# EAGLE design SmartCar Arduino V1 (EAGLE 9.6.2)
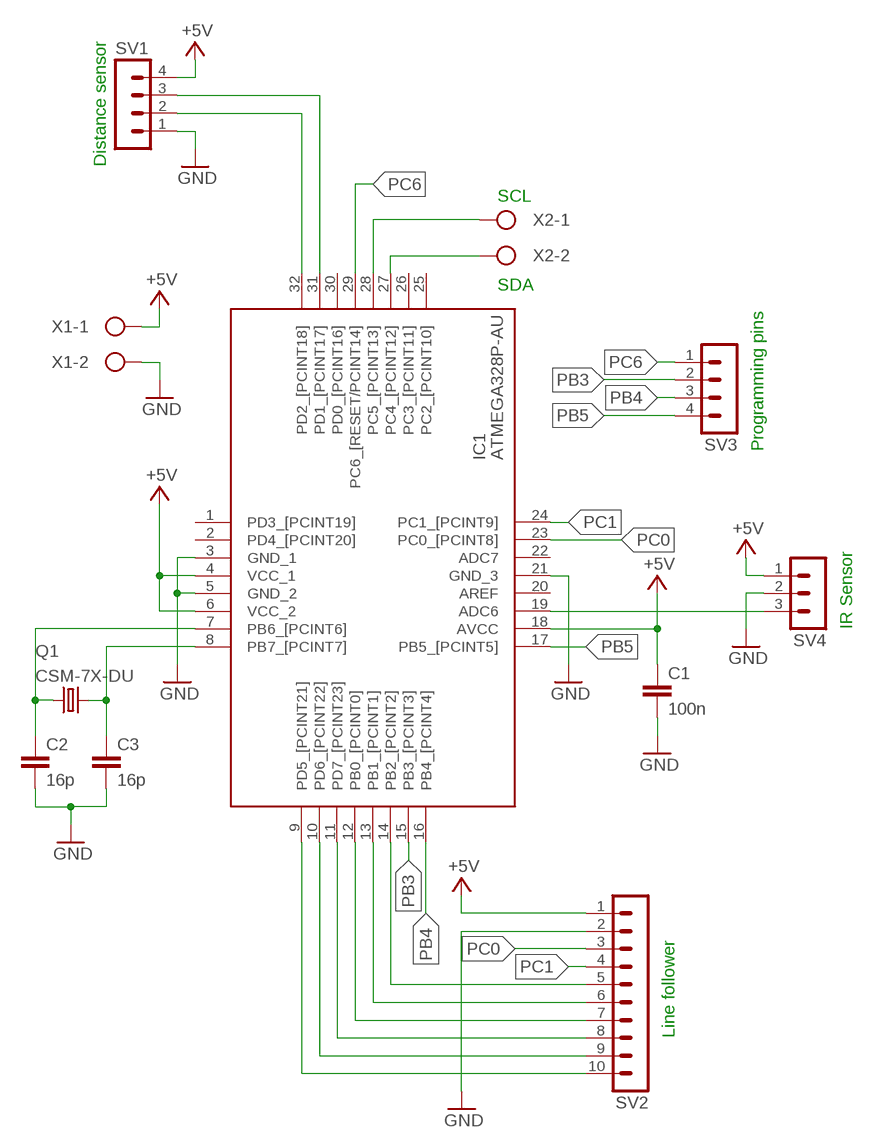
[diagram p0: schematic, sheet 1]

## Parts
C1  100n  C-EUC0805  [C0805]
C2  16p  C-EUC0805  [C0805]
C3  16p  C-EUC0805  [C0805]
IC1  ATMEGA328P-AU  [QFP80P900X900X120-32N]
Q1  CSM-7X-DU  [CSM-7X-DU]
SV1  MA04-1  [MA04-1]
SV2  MA10-1  [MA10-1]
SV3  MA04-1  [MA04-1]
SV4  MA03-1  [MA03-1]
X1  W237-102  [W237-102]
X2  W237-102  [W237-102]

## Nets
+5V: C1.1 IC1.4(VCC_1) IC1.6(VCC_2) IC1.18(AVCC) SV1.4 SV2.1 SV4.1 X1.1
GND: C1.2 C2.2 C3.2 IC1.3(GND_1) IC1.5(GND_2) IC1.21(GND_3) SV1.1 SV2.2 SV4.2 X1.2
N$1: IC1.27(PC4_[PCINT12]) X2.2
N$2: IC1.28(PC5_[PCINT13]) X2.1
N$3: C2.1 IC1.7(PB6_[PCINT6]) Q1.1
N$4: C3.1 IC1.8(PB7_[PCINT7]) Q1.2
N$5: IC1.32(PD2_[PCINT18]) SV1.2
N$6: IC1.31(PD1_[PCINT17]) SV1.3
N$7: IC1.19(ADC6) SV4.3
N$11: IC1.14(PB2_[PCINT2]) SV2.5
N$12: IC1.13(PB1_[PCINT1]) SV2.6
N$13: IC1.12(PB0_[PCINT0]) SV2.7
N$14: IC1.11(PD7_[PCINT23]) SV2.8
N$15: IC1.10(PD6_[PCINT22]) SV2.9
N$16: IC1.9(PD5_[PCINT21]) SV2.10
PB3: IC1.15(PB3_[PCINT3]) SV3.2
PB4: IC1.16(PB4_[PCINT4]) SV3.3
PB5: IC1.17(PB5_[PCINT5]) SV3.4
PC0: IC1.23(PC0_[PCINT8]) SV2.3
PC1: IC1.24(PC1_[PCINT9]) SV2.4
PC6: IC1.29(PC6_[RESET/PCINT14]) SV3.1
Unconnected: IC1.1(PD3_[PCINT19]) IC1.2(PD4_[PCINT20]) IC1.20(AREF) IC1.22(ADC7) IC1.25(PC2_[PCINT10]) IC1.26(PC3_[PCINT11]) IC1.30(PD0_[PCINT16])

## Notes on the sheet
- Distance sensor
- SCL
- SDA
- Programming pins
- IR Sensor
- Line follower

## Library data of the parts
C1-C3 = rcl:C-EU: CAPACITOR, European symbol; SPICEPREFIX: C
IC1 = ATMEGA328P-AU:ATMEGA328P-AU: MICROCHIP - ATMEGA328P-AU. - MICROCONTROLLER MCU, 8 BIT, ATMEGA, 20MHZ, TQFP-32 Source: Datasheet <https://componentsearchengine.com/Datasheets/2/ATMEGA328P-AU.pdf>; ARROW_PART_NUMBER: ATMEGA328P-AU; ARROW_PRICE-STOCK: https://www.arrow.com/en/products/atmega328p-au/microchip-technology?region=nac; DESCRIPTION: MICROCHIP - ATMEGA328P-AU. - MICROCONTROLLER MCU, 8 BIT, ATMEGA, 20MHZ, TQFP-32; HEIGHT: 1.2mm; MANUFACTURER_NAME: Microchip; MANUFACTURER_PART_NUMBER: ATMEGA328P-AU; MOUSER_PART_NUMBER: 556-ATMEGA328P-AU; MOUSER_PRICE-STOCK: https://www.mouser.co.uk/ProductDetail/Microchip-Technology-Atmel/ATMEGA328P-AU?qs=K8BHR703ZXiCmmgp6%2FGNmQ%3D%3D
Q1 = crystal:CSM-7X-DU: SMD CRYSTAL Source: www.ecsxtal.com .. Crystal 3.6864MHz CSM_7X_DU.PDF; OC_FARNELL: unknown; OC_NEWARK: unknown
SV1 SV3 = con-lstb:MA04-1: PIN HEADER; OC_FARNELL: unknown; OC_NEWARK: unknown
SV2 = con-lstb:MA10-1: PIN HEADER; OC_FARNELL: unknown; OC_NEWARK: unknown
SV4 = con-lstb:MA03-1: PIN HEADER; OC_FARNELL: unknown; OC_NEWARK: unknown
X1 X2 = con-wago-500:W237-102: WAGO SCREW CLAMP; MPN: 237-102; OC_FARNELL: unknown; OC_NEWARK: 70K9898

## Board
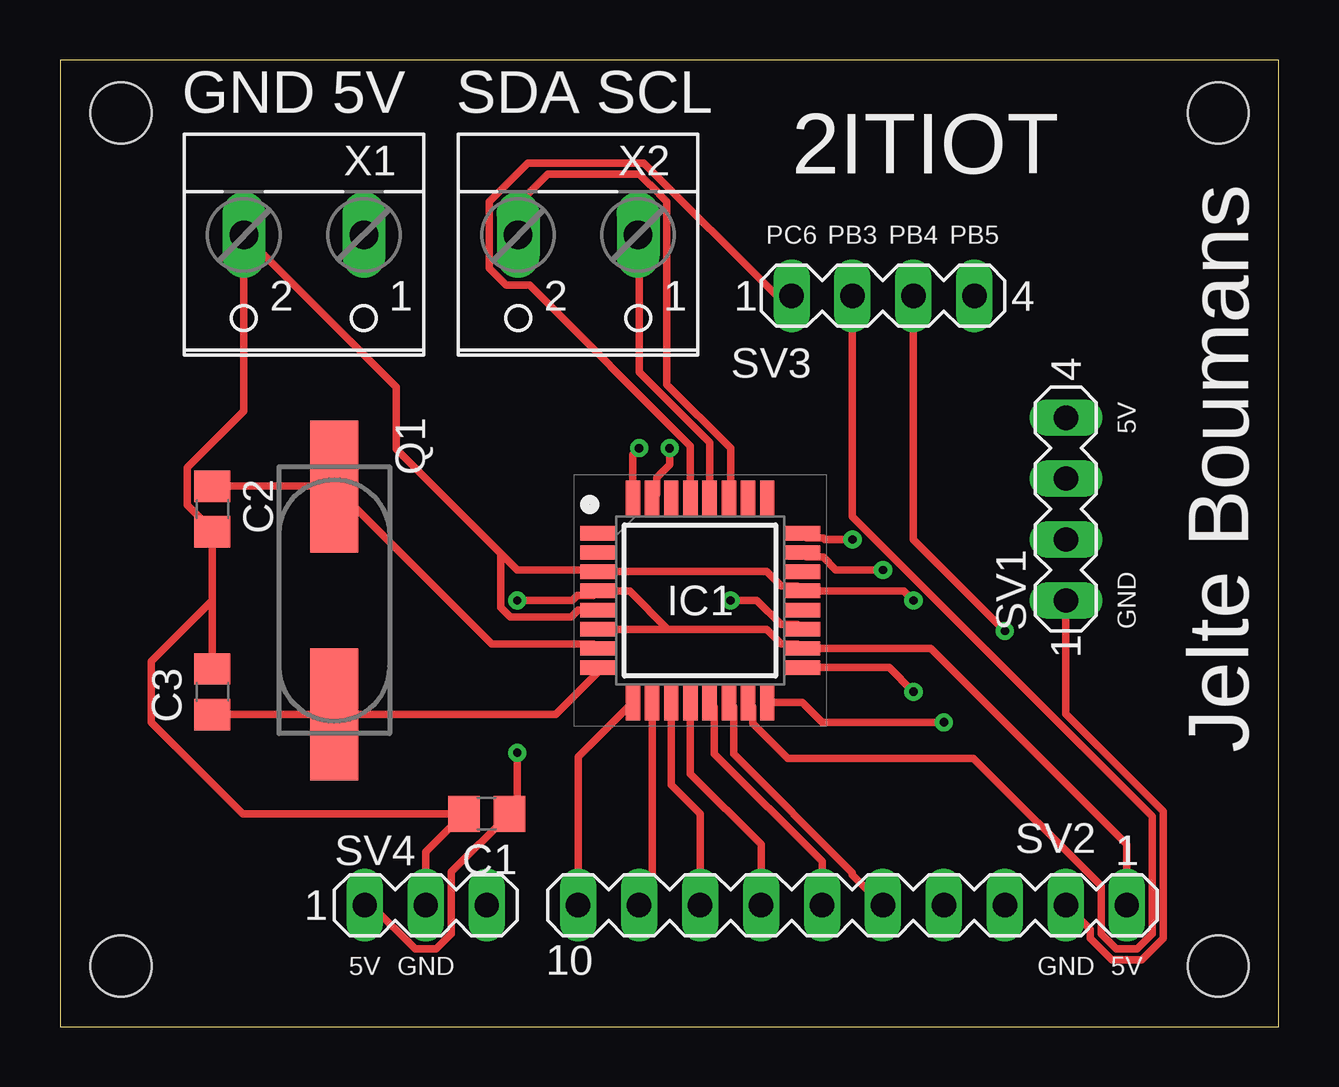
[diagram p1: board, top side]
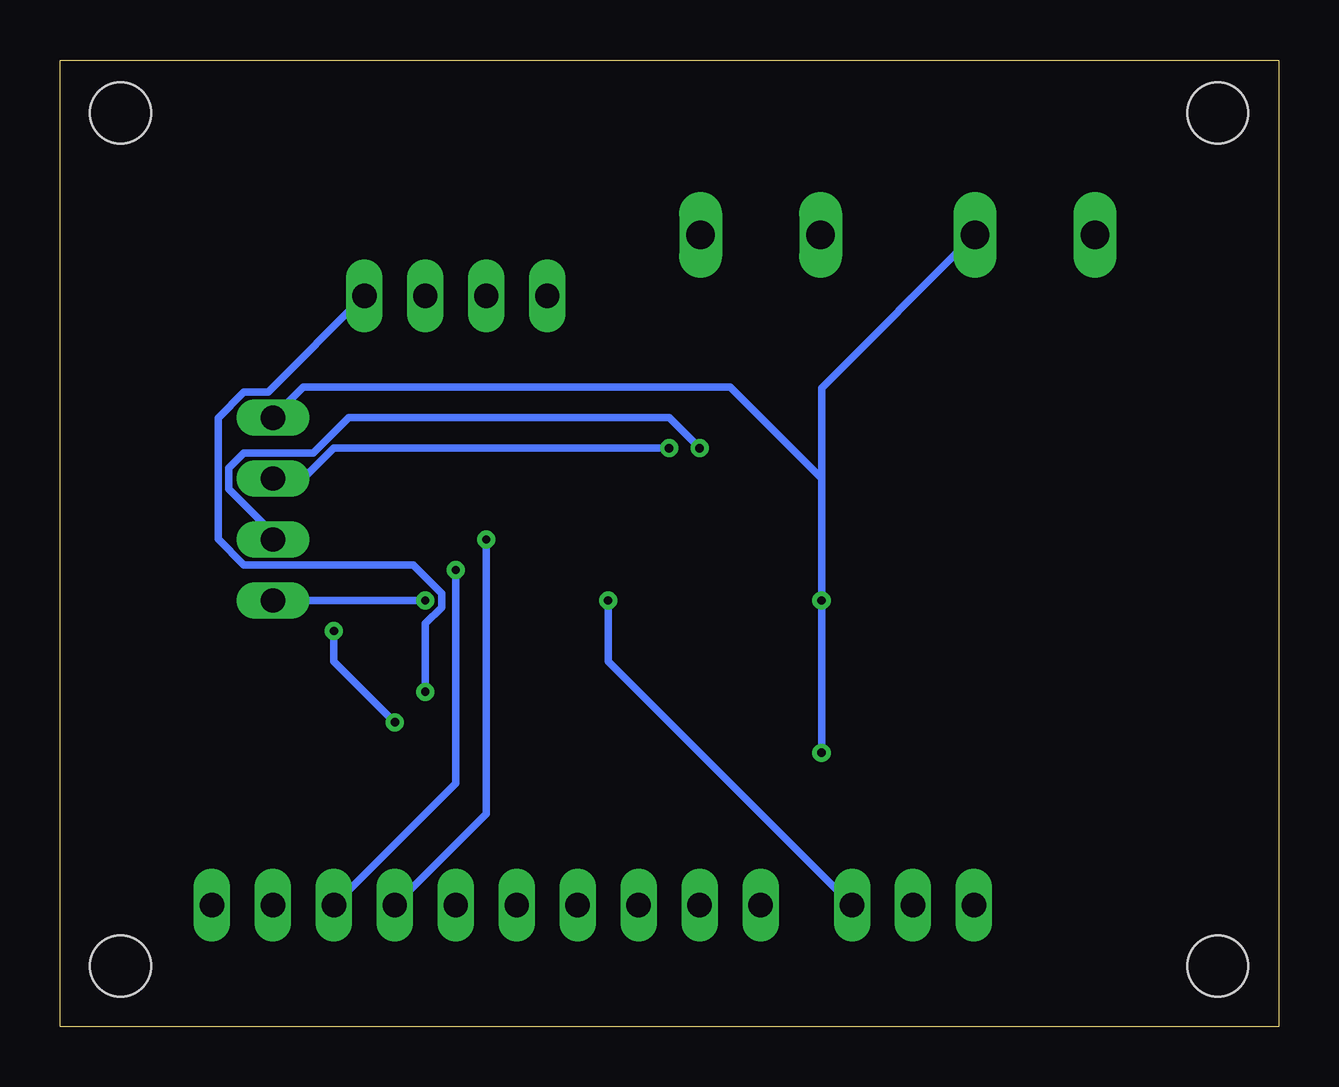
[diagram p2: board, bottom side, seen from below]

Size 50.78 x 40.31 mm. Coordinates in mm from the lower left corner, seen from the top.
Outline: 0,0 50.78,0 50.78,40.31 0,40.31 0,0
Copper layers (1*16): Top 0.035mm / dielectric 0.15mm / Bottom 0.035mm
Design rules "default": minimum track width 6mil, minimum drill 0.35mm, track to track 6mil, track to pad 6mil, pad to pad 6mil, via to via 6mil, smd to smd 6mil, copper to edge 40mil, drill to drill 6mil, minimum pad ring 10mil, minimum via ring 8mil, stop-mask expansion 4mil, vias tented up to drill 0mil, thermal gap 10mil
Holes 2.54 mm at 48.26,2.54 2.54,2.54 48.26,38.1 2.54,38.1

### Footprints (pad centres in the part's own frame; a part is rotated, then mirrored left to right if it is on the bottom)
C0805 = smd 1.3 x 1.5: 1 -0.95,0; 2 0.95,0
QFP80P900X900X120-32N = smd 1.5 x 0.6: 1 -4.25,2.8; 2 -4.25,2; 3 -4.25,1.2; 4 -4.25,0.4; 5 -4.25,-0.4; 6 -4.25,-1.2; 7 -4.25,-2; 8 -4.25,-2.8; 17 4.25,-2.8; 18 4.25,-2; 19 4.25,-1.2; 20 4.25,-0.4; 21 4.25,0.4; 22 4.25,1.2; 23 4.25,2; 24 4.25,2.8 | smd 0.6 x 1.5: 9 -2.8,-4.25; 10 -2,-4.25; 11 -1.2,-4.25; 12 -0.4,-4.25; 13 0.4,-4.25; 14 1.2,-4.25; 15 2,-4.25; 16 2.8,-4.25; 25 2.8,4.25; 26 2,4.25; 27 1.2,4.25; 28 0.4,4.25; 29 -0.4,4.25; 30 -1.2,4.25; 31 -2,4.25; 32 -2.8,4.25
CSM-7X-DU = smd 5.5 x 2: 1 -4.75,0; 2 4.75,0
MA04-1 = drill 1.016 long: 1 -3.81,0; 2 -1.27,0; 3 1.27,0; 4 3.81,0
MA10-1 = drill 1.016 long: 1 -11.43,0; 2 -8.89,0; 3 -6.35,0; 4 -3.81,0; 5 -1.27,0; 6 1.27,0; 7 3.81,0; 8 6.35,0; 9 8.89,0; 10 11.43,0
MA03-1 = drill 1.016 long: 1 -2.54,0; 2 0,0; 3 2.54,0
W237-102 = drill 1.194 long: 1 -2.5,-1.27; 2 2.5,-1.27

### Placement (x,y rotation side)
C1  17.78,8.89 180 top
C2  6.35,21.59 270 top
C3  6.35,13.97 90 top
IC1  26.67,17.78 0 top
Q1  11.43,17.78 270 top
SV1  41.91,21.59 90 top
SV2  33.02,5.08 180 top
SV3  34.29,30.48 0 top
SV4  15.24,5.08 0 top
X1  10.16,31.75 180 top
X2  21.59,31.75 180 top

### Tracks (layer width: path | path; a pad name or v marks a point on that pad's centre or on a via)
+5V  (via drill 0.35)
  Top 0.305: IC1.6 25.33,16.58 | 25.33,16.58 29.44,16.58 30.04,15.97 30.73,15.97 IC1.18 36.29,15.78 44.45,7.62 SV2.1 | 25.33,16.58 23.73,18.18 IC1.4 22.23,17.98 21.54,17.98 21.34,17.78 v19.05,17.78 | v19.05,11.43 19.05,9.21 C1.1 16.31,6.47 16.31,3.88 15.68,3.25 14.8,3.25 12.97,5.08 SV4.1
  Bottom 0.305: 19.05,22.86 v19.05,17.78 v19.05,11.43 | SV1.4 40.64,26.67 22.86,26.67 19.05,22.86 | 19.05,22.86 19.05,26.63 X1.1
GND  (via drill 0.35)
  Top 0.305: 6.35,17.78 C2.2 6.35,20.71 5.29,21.76 5.29,23.32 7.66,25.68 X1.2 14.01,26.67 14.01,24.09 18.37,19.73 | 6.35,17.78 C3.2 | IC1.3 22.86,18.98 | 22.86,18.98 29.44,18.98 30.04,18.38 30.73,18.38 IC1.21 35.16,18.18 v35.56,17.78 | 18.37,19.73 19.05,19.05 22.79,19.05 22.86,18.98 | IC1.5 21.59,17.38 21.3,17.1 18.77,17.1 18.37,17.5 18.37,19.73 | 6.35,17.78 3.81,15.24 3.81,12.7 7.62,8.89 C1.2 15.24,7.3 SV4.2 | SV1.1 41.91,13.04 45.97,8.98 45.97,3.69 45.08,2.79 43.82,2.79 42.93,3.69 42.93,4.06 SV2.2
  Bottom 0.305: SV1.1 v35.56,17.78
N$1
  Top 0.305: IC1.27 27.94,22.1 27.94,24.13 25.29,26.78 25.29,34.41 24.59,35.12 24.57,35.12 24.13,35.56 20.32,35.56 19.09,34.33 X2.2
N$2
  Top 0.305: IC1.28 27.07,24.35 24.13,27.29 24.13,32.98 X2.1
N$3
  Top 0.305: C2.1 Q1.1 17.98,15.97 22.23,15.97 IC1.7
N$4
  Top 0.305: C3.1 Q1.2 20.65,13.03 22.42,14.8 IC1.8
N$5  (via drill 0.35)
  Top 0.305: IC1.32 23.87,23.87 v24.13,24.13
  Bottom 0.305: v24.13,24.13 25.4,25.4 38.75,25.4 40.22,23.93 43.11,23.93 43.74,23.3 43.74,22.42 41.91,20.59 SV1.2
N$6  (via drill 0.35)
  Top 0.305: IC1.31 24.86,22.23 24.86,22.91 25.4,23.44 v25.4,24.13
  Bottom 0.305: SV1.3 40.64,22.86 39.37,24.13 v25.4,24.13
N$7  (via drill 0.35)
  Top 0.305: v27.94,17.78 29.04,17.78 30.04,16.77 30.73,16.77 IC1.19
  Bottom 0.305: SV4.3 27.94,15.24 v27.94,17.78
N$11
  Top 0.305: IC1.14 28.07,13.34 28.07,11.38 33.02,6.43 33.02,6.35 SV2.5
N$12
  Top 0.305: IC1.13 27.27,13.34 27.27,11.38 31.75,6.9 SV2.6
N$13
  Top 0.305: IC1.12 26.27,10.56 29.21,7.62 SV2.7
N$14
  Top 0.305: IC1.11 25.47,10.09 26.67,8.89 SV2.8
N$15
  Top 0.305: IC1.10 24.67,5.62 SV2.9
N$16
  Top 0.305: IC1.9 21.59,11.25 SV2.10
PB3
  Top 0.305: SV3.2 33.02,21.29 45.52,8.79 45.52,3.88 44.89,3.25 44.01,3.25 43.38,3.88 43.38,5.88 38.05,11.21 30.31,11.21 28.86,12.65 28.86,13.34 IC1.15
PB4  (via drill 0.35)
  Top 0.305: IC1.16 30.92,13.53 31.75,12.7 v36.83,12.7 | v39.37,16.51 35.56,20.32 SV3.3
  Bottom 0.305: v36.83,12.7 39.37,15.24 v39.37,16.51
PB5  (via drill 0.35)
  Top 0.305: IC1.17 34.55,14.98 v35.56,13.97
  Bottom 0.305: SV3.4 42.11,26.47 43.11,26.47 44.2,25.39 44.2,20.34 43.11,19.25 36.07,19.25 34.88,18.06 34.88,17.5 35.56,16.81 v35.56,13.97
PC0  (via drill 0.35)
  Top 0.305: IC1.23 31.11,19.59 31.8,19.59 32.33,19.05 v34.29,19.05
  Bottom 0.305: SV2.3 34.29,10.16 v34.29,19.05
PC1  (via drill 0.35)
  Top 0.305: v33.02,20.32 31.86,20.32 31.8,20.39 31.11,20.39 IC1.24
  Bottom 0.305: SV2.4 33.02,8.89 v33.02,20.32
PC6
  Top 0.305: SV3.1 29.87,30.48 24.33,36.02 19.5,36.02 17.89,34.41 17.89,31.63 18.59,30.92 19.57,30.92 26.27,24.23 IC1.29

### Text on the board
tNames: GND 5V | SDA SCL | 2ITIOT | PC6 | PB3 | PB4 | PB5 | 5V | GND | Jelte Boumans | 5V | GND | GND | 5V